# Altium schematic sheet MAGI'sBuckPower.SchDoc
size A4
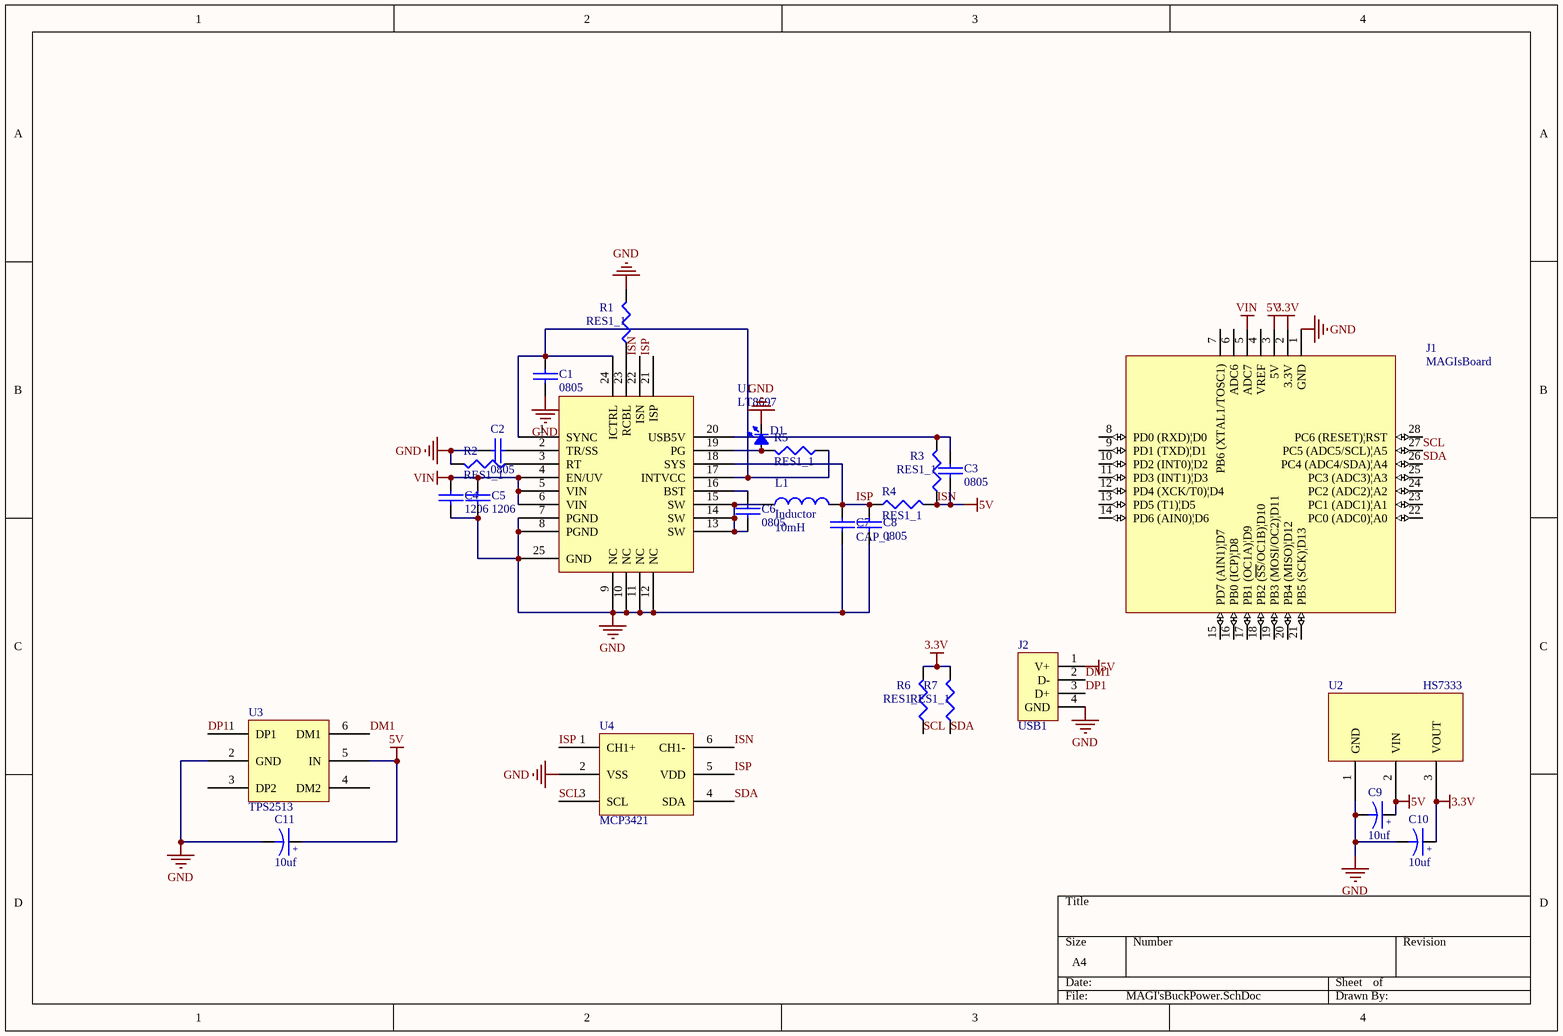
[diagram p0: MAGI'sBuckPower.SchDoc]

## Parts
C1  0805  [6-0805_N]
C2  0805  [6-0805_N]
C3  0805  [6-0805_N]
C4  1206  [C1206]
C5  1206  [C1206]
C6  0805  [6-0805_N]
C7  CAP_1  [6TPE330M]
C8  0805  [C1210_N]
C9  10uf  [6-0805_n]
C10  10uf  [6-0805_n]
C11  10uf  [6-0805_N]
D1  LED_0805  [6-0805_n]  (value not drawn)
J1  MAGIsBoard  [MAGIsBoard]
J2  USB1  [USB-04A]
L1  Inductor  value 10mH  [7*7]
R1  RES1_1  [6-0805_n]
R2  RES1_1  [6-0805_n]
R3  RES1_1  [6-0805_n]
R4  RES1_1  [2512]
R5  RES1_1  [6-0805_n]
R6  RES1_1  [6-0805_n]
R7  RES1_1  [6-0805_n]
U1  LT8697  [lt8697]
U2  HS7333  [HS7333]
U3  TPS2513  [TPS2513]
U4  MCP3421  [tps2513]

## Nets
3.3V: C10.1 J1.2(3.3V) R6.2 R7.2 U2.3(VOUT)
GND: C1.1 C2.2 C4.1 C5.1 C7.2 C8.2 C9.2 C10.2 C11.2 D1.2(K) J1.1(GND) J2.4(GND) R1.2 R2.2 U1.7(PGND) U1.8(PGND) U1.9(NC) U1.10(NC) U1.11(NC) U1.12(NC) U1.25(GND) U2.1(GND) U3.2(GND) U4.2(VSS)
ISN: C3.1 C9.1 C11.1 J1.3(5V) J2.1(V+) R3.1 R4.2 U1.22(ISN) U2.2(VIN) U3.5(IN) U4.6(CH1-)  [also labelled 5V]
VIN: C4.2 C5.2 J1.5(ADC7) U1.4(EN/UV) U1.5(VIN) U1.6(VIN)
DM1: J2.2(D-) U3.6(DM1)
DP1: J2.3(D+) U3.1(DP1)
ISP: C7.1 C8.1 L1.2 R4.1 U1.18(SYS) U1.21(ISP) U4.1(CH1+) U4.5(VDD)
SCL: J1.27(PC5_(ADC5/SCL)|A5) R6.1 U4.3(SCL)
SDA: J1.26(PC4_(ADC4/SDA)|A4) R7.1 U4.4(SDA)
NetC1_2: C1.2 R5.1 U1.1(SYNC) U1.17(INTVCC) U1.24(ICTRL)
NetC2_1: C2.1 U1.2(TR/SS)
NetC3_2: C3.2 R3.2 U1.20(USB5V)
NetC6_1: C6.1 L1.1 U1.13(SW) U1.14(SW) U1.15(SW)
NetC6_2: C6.2 U1.16(BST)
NetD1_1: D1.1(A) R5.2 U1.19(PG)
NetR1_1: R1.1 U1.23(RCBL)
NetR2_1: R2.1 U1.3(RT)

Not connected (* = marked no-connect by the designer): J1 4(VREF) 6(ADC6) 7(PB6_(XTAL1/TOSC1)) 8(PD0_(RXD)|D0) 9(PD1_(TXD)|D1) 10(PD2_(INT0)|D2) 11(PD3_(INT1)|D3) 12(PD4_(XCK/T0)|D4) 13(PD5_(T1)|D5) 14(PD6_(AIN0)|D6) 15(PD7_(AIN1)|D7) 16(PB0_(ICP)|D8) 17(PB1_(OC1A)|D9) 18(PB2_(~{SS}/OC1B)|D10) 19(PB3_(MOSI/OC2)|D11) 20(PB4_(MISO)|D12) 21(PB5_(SCK)|D13) 22(PC0_(ADC0)|A0) 23(PC1_(ADC1)|A1) 24(PC2_(ADC2)|A2) 25(PC3_(ADC3)|A3) 28(PC6_(RESET)|RST); U3 3(DP2) 4(DM2)

## Notes on the sheet
- (in symbol CAPACITOR POL) +

## Library data of the parts
C1-C8 = CAP_1: Capacitor
C9-C11 = CAPACITOR POL: Capacitor
D1 = LED_0805: LED
L1 = Inductor: Code_IEC: 1005; Published: 8-Jun-2000; LatestRevisionDate: 29-May-2009; LatestRevisionNote: IPC-7351 Footprint Added.; PackageReference: 0402-A; Publisher: Altium Limited; PackageDescription: Chip Inductor; Code_JEITA: 0402